# Altium schematic sheet LinearSensor_inputs.SchDoc: Linear sensor input
size A4; Engineer: Danel Tiitma; Organization: MTÜ Tudengi Vormel; Address1: Pärnu mnt 62; Address2: Tallinn; Address3: Estonia, 10135; DocumentNumber: 10; Revision: 1; SheetNumber: 11; SheetTotal: 15
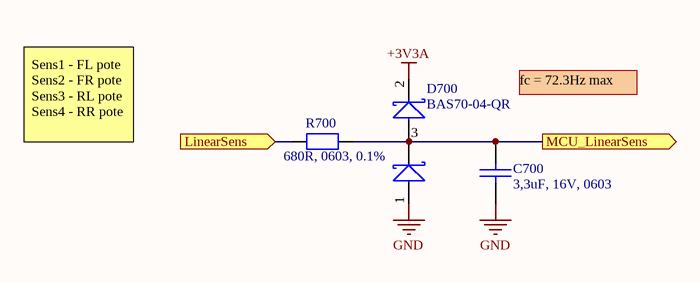
[diagram p0: LinearSensor_inputs.SchDoc]

## Parts
C700  3,3uF, 16V, 0603  [CAP [0603] 1608]
D700  BAS70-04-QR  [SOT23-3]
R700  680R, 0603, 0.1%  [RES [0603] 1608]

## Ports
LinearSens (in), MCU_LinearSens (out)

## Nets
+3V3A: D700.2
GND: C700.2 D700.1
LinearSens: R700.2 ; port LinearSens
MCU_LinearSens: C700.1 D700.3 R700.1 ; port MCU_LinearSens

## Notes on the sheet
- fc = 72.3Hz max
- Sens1 - FL pote
  Sens2 - FR pote
  Sens3 - RL pote
  Sens4 - RR pote
- Engineer:
- Date:
- Rev:

## Library data of the parts
C700 = CMP-001-00084-16: Default capacitor part; Supplier Part Number: *; Supplier: *; Manufacturer Part Number: *
D700 = CMP-004-00033-4: Diode Small Signal Schottky 70V 70mA 3-Pin SOT-23 T/R; Manufacturer: Nexperia; Supplier Part Number: 771-BAS70-04-QR; Manufacturer Part Number: BAS70-04-QR; Supplier: Mouser; Price: 0,242
R700 = CMP-009-00038-12: Standard resistor part; Supplier Part Number: *; Manufacturer Part Number: *; Supplier: *